# EAGLE schematic kiosk_buttons_revA (EAGLE 9.0.0)
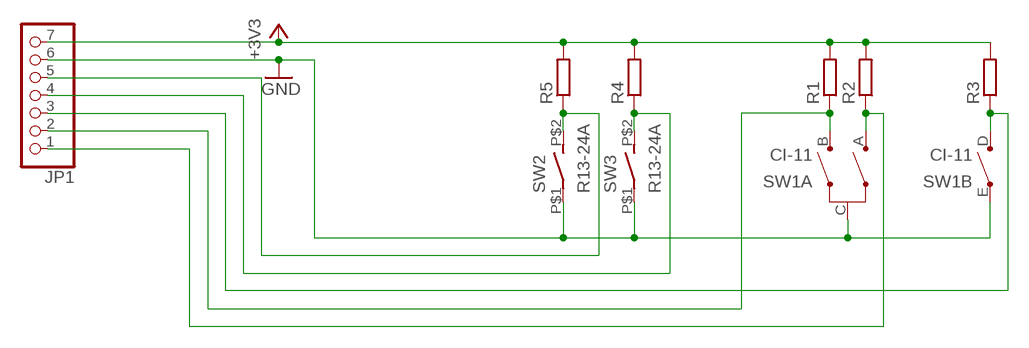
[diagram p0: schematic, sheet 1]

## Parts
JP1  PINHD-1X7  [1X07]
R1  R-EU_0204/2V  [0204V]
R2  R-EU_0204/2V  [0204V]
R3  R-EU_0204/2V  [0204V]
R4  R-EU_0204/2V  [0204V]
R5  R-EU_0204/2V  [0204V]
SW1  CI-11  [CI-11]
SW2  R13-24A  [R13-24]
SW3  R13-24A  [R13-24]

## Nets
+3V3: JP1.7 R1.2 R2.2 R3.2 R4.2 R5.2
GND: JP1.6 SW1.C(A:C) SW1.E(B:E) SW2.P$1(P) SW3.P$1(P)
N$1: JP1.3 R3.1 SW1.D(B:D)
N$2: JP1.4 R4.1 SW3.P$2(S)
N$3: JP1.5 R5.1 SW2.P$2(S)
N$4: JP1.2 R1.1 SW1.B(A:B)
N$5: JP1.1 R2.1 SW1.A(A:A)

## Library data of the parts
JP1 = pinhead:PINHD-1X7: PIN HEADER
R1-R5 = resistor:R-EU_: RESISTOR, European symbol
SW1 = piher:CI-11: 11mm Incemental Encoder Source: www.piher.net .. 04-CI-11v04.pdf; OC_FARNELL: unknown; OC_NEWARK: unknown
SW2 SW3 = kiosk:R13-24A; MF: SCI